# Altium schematic sheet BOSE.SchDoc
size A4
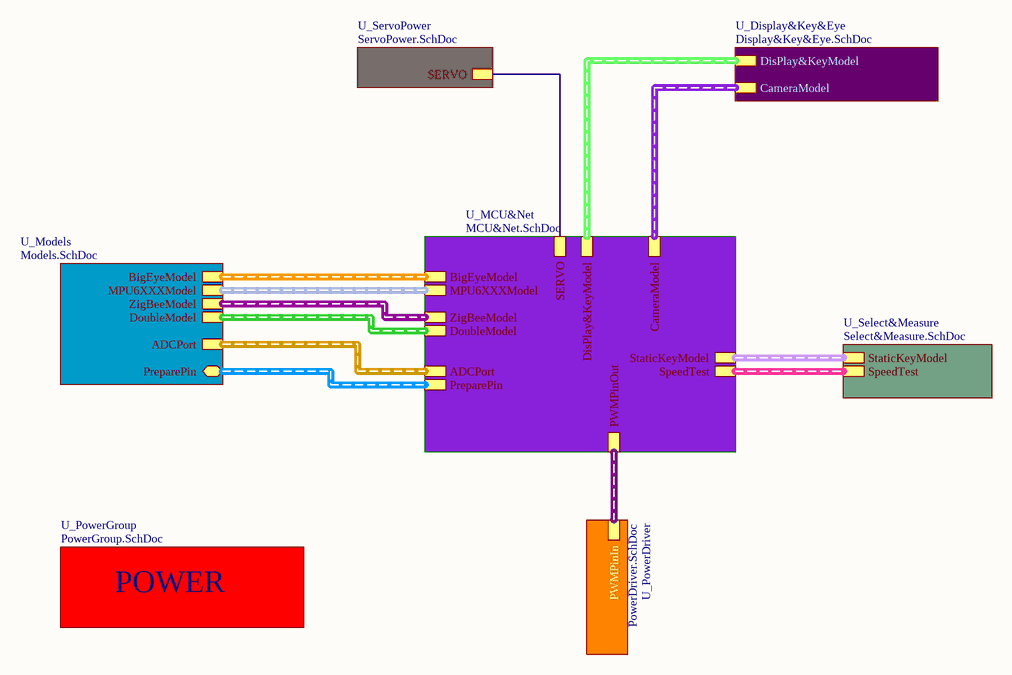
[diagram p0: BOSE.SchDoc]

## Sub-sheets
U_Display&Key&Eye = Display&Key&Eye.SchDoc: DisPlay&KeyModel (harness Display&Key), CameraModel (harness Camera)
U_MCU&Net = MCU&Net.SchDoc: ZigBeeModel (harness ZigBeeModel), CameraModel (harness Camera), BigEyeModel (harness BigEye), DisPlay&KeyModel (harness Display&Key), PWMPinOut (harness PWMPin), MPU6XXXModel (harness MPU6XXX), DoubleModel (harness Double), SpeedTest (harness Speed), SERVO, StaticKeyModel (harness StaticKey), PreparePin (harness Prepare), ADCPort (harness ADCPort)
U_Models = Models.SchDoc: MPU6XXXModel (harness MPU6XXX), ZigBeeModel (harness ZigBeeModel), BigEyeModel (harness BigEye), DoubleModel (harness Double), ADCPort (harness ADCPort), PreparePin (harness Prepare)
U_PowerDriver = PowerDriver.SchDoc: PWMPinIn (harness PWMPin)
U_PowerGroup = PowerGroup.SchDoc: no entries
U_Select&Measure = Select&Measure.SchDoc: SpeedTest (harness Speed), StaticKeyModel (harness StaticKey)
U_ServoPower = ServoPower.SchDoc: SERVO

## Nets
(unnamed): sheet U_MCU&Net/SERVO, sheet U_ServoPower/SERVO

## Buses and harness runs
harness sheet U_Display&Key&Eye/CameraModel = sheet U_MCU&Net/CameraModel
harness sheet U_Display&Key&Eye/DisPlay&KeyModel = sheet U_MCU&Net/DisPlay&KeyModel
harness sheet U_MCU&Net/ADCPort = sheet U_Models/ADCPort
harness sheet U_MCU&Net/BigEyeModel = sheet U_Models/BigEyeModel
harness sheet U_MCU&Net/DoubleModel = sheet U_Models/DoubleModel
harness sheet U_MCU&Net/MPU6XXXModel = sheet U_Models/MPU6XXXModel
harness sheet U_MCU&Net/PreparePin = sheet U_Models/PreparePin
harness sheet U_MCU&Net/PWMPinOut = sheet U_PowerDriver/PWMPinIn
harness sheet U_MCU&Net/SpeedTest = sheet U_Select&Measure/SpeedTest
harness sheet U_MCU&Net/StaticKeyModel = sheet U_Select&Measure/StaticKeyModel
harness sheet U_MCU&Net/ZigBeeModel = sheet U_Models/ZigBeeModel

## Notes on the sheet
- POWER